# EasyEDA schematic schematics.json
TITLE: Esp32 Radar Scanner; REV: 1.0; Date: 2026-01-19; Sheet: 1/1; Drawn By: mohammadsarfaraz
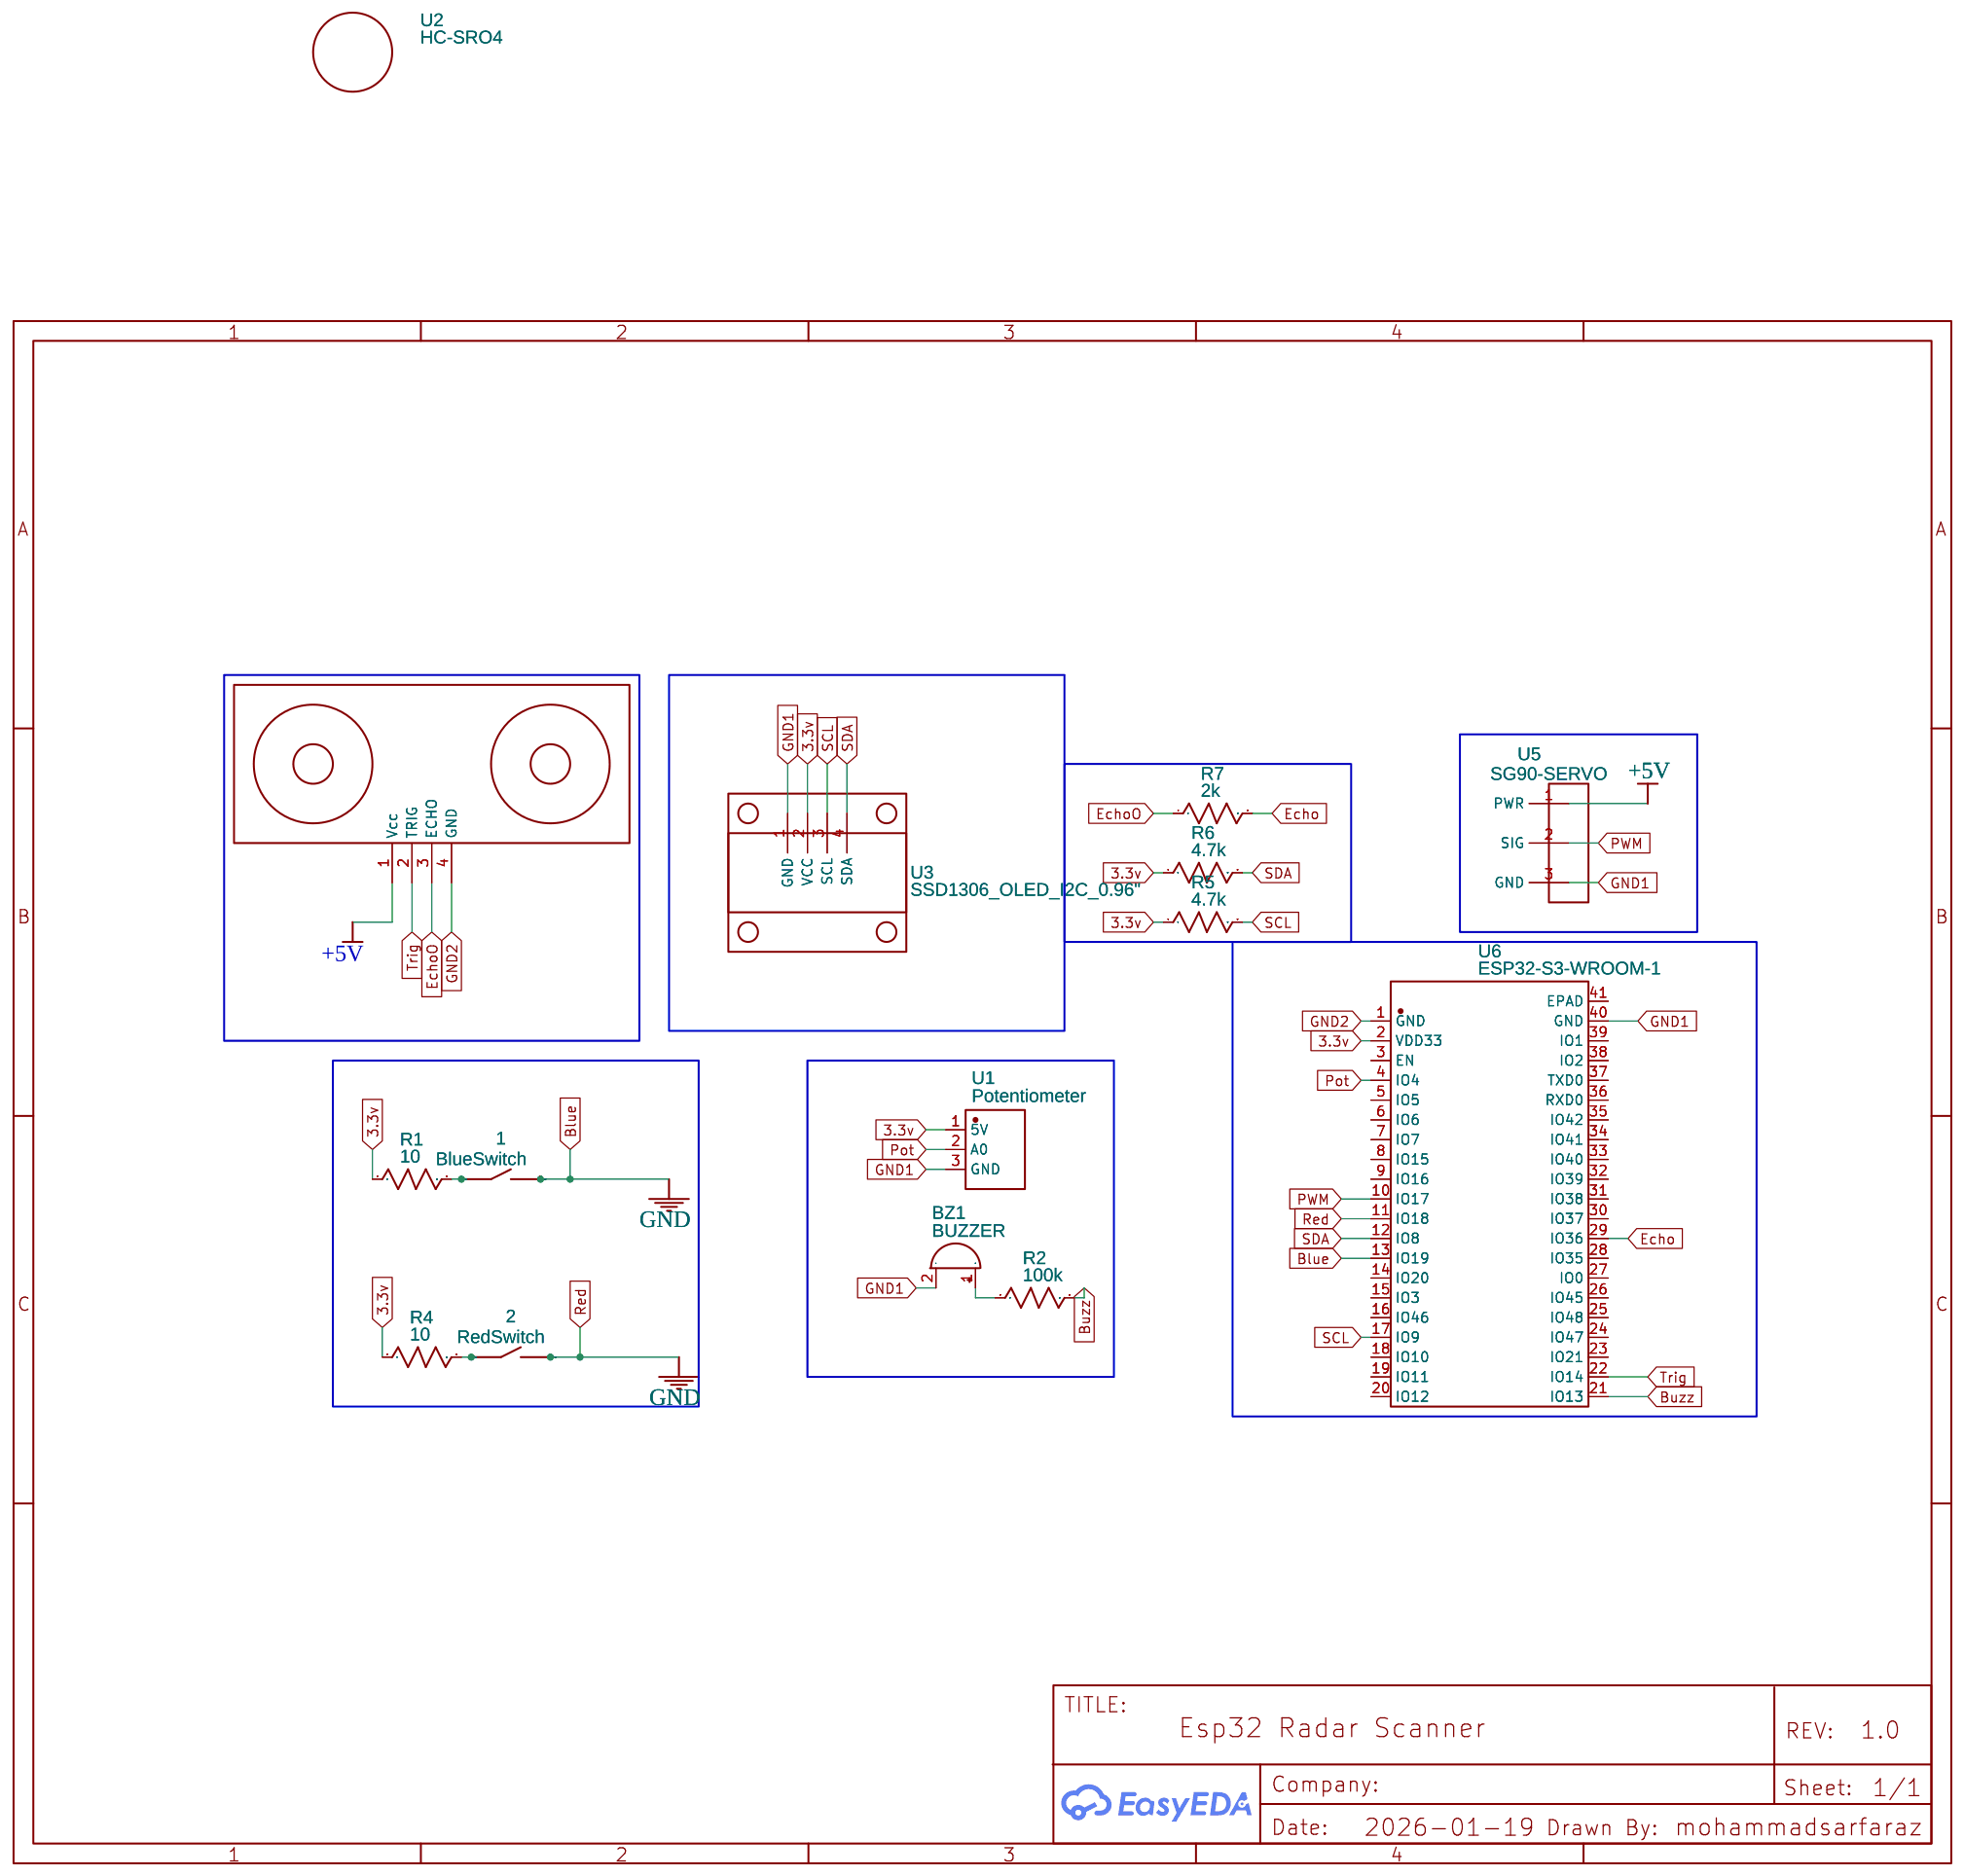
[diagram p0: schematic sheet]

## Parts
1  BlueSwitch  [SMD-4.5X4.5-TACTILE-PUSH-BUTTON]
2  RedSwitch  [SMD-4.5X4.5-TACTILE-PUSH-BUTTON]
BZ1  BUZZER  [BUZZER_BEEPER:BUZZER_12X9.5RM7.6]
R1  10  [R0603]
R2  100k  [R0603]
R4  10  [R0603]
R5  4.7k  [R0603]
R6  4.7k  [R0603]
R7  2k  [R0603]
U1  Potentiometer  [POTENTIOMETER10K]
U2  HC-SRO4
U3  SSD1306_OLED_I2C_0.96"  [SSD1306_OLED_I2C_0.96"]
U5  SG90-SERVO  [SG90-SERVO]
U6  ESP32-S3-WROOM-1  [ESP32-S3-WROOM-1]

## Library data of the parts
1 2 = 4.5X4.5-SMD-TACTILE-SWITCH: Contributor: Aman Verma
BZ1 = BUZZER 12X9.5 FATHBOARD: Symbol: Device_Buzzer; Device: Device_Buzzer; Add into BOM: yes; Convert to PCB: yes; Origin Footprint: Buzzer_Beeper:Buzzer_12x9.5RM7.6; Contributor: myboomybott
R1 R2 R4-R7 = R_0603_US: Contributor: LCEDA_Lib
U1 = Potentiometer: Contributor: eileen03
U2 = HC-SRO4: Contributor: lusc23067
U3 = SSD1306_OLED_I2C_0.96": Contributor: peterch84
U5 = SG90-SERVO: Contributor: theonegareth
U6 = ESP32-S3-WROOM-1: Manufacturer: Espressif Systems; Supplier: LCSC; Contributor: abubakarsanim01

## Nets
3.3v: R1.1 R4.1 R5.1 R6.1 U1.1(5V) U3.2(VCC) U6.2(VDD33)
+5V: U2.1(Vcc) U5.1(PWR)
GND1: BZ1.2(-) U1.3(GND) U3.1(GND) U5.3(GND) U6.40(GND)
GND2: U2.4(GND) U6.1(GND)
Blue: 1.2.1(S2) 1.2.2(S2) 2.2.1(S2) 2.2.2(S2) U6.11(IO18) U6.13(IO19)
Buzz: R2.2 U6.21(IO13)
Echo: R7.2 U6.29(IO36)
EchoO: R7.1 U2.3(ECHO)
Pot: U1.2(A0) U6.4(IO4)
PWM: U5.2(SIG) U6.10(IO17)
SCL: R5.2 U3.3(SCL) U6.17(IO9)
SDA: R6.2 U3.4(SDA) U6.12(IO8)
Trig: U2.2(TRIG) U6.22(IO14)
Net-(1-1.1): 1.1.1(S1) 1.1.2(S1) R1.2
Net-(2-1.1): 2.1.1(S1) 2.1.2(S1) R4.2
Net-(BZ1-1): BZ1.1(+) R2.1

Not connected (* = marked no-connect by the designer): U6 3(EN) 5(IO5) 6(IO6) 7(IO7) 8(IO15) 9(IO16) 14(IO20) 15(IO3) 16(IO46) 18(IO10) 19(IO11) 20(IO12) 23(IO21) 24(IO47) 25(IO48) 26(IO45) 27(IO0) 28(IO35) 30(IO37) 31(IO38) 32(IO39) 33(IO40) 34(IO41) 35(IO42) 36(RXD0) 37(TXD0) 38(IO2) 39(IO1) 41(EPAD)
